# Altium schematic sheet Dissipation de puissance.SchDoc: =SchTitle
size 276 x 198 mm; Organization: ETML; Address1: Rue de Sébeillon12; Address2: CH - 1004 Lausanne; Address3: Tél. 021 316 77 77; Address4: www.etml.ch; SheetNumber: 2; SheetTotal: 4; Replace: .; ModA: .; ModB: .; ModC: .; ModD: .
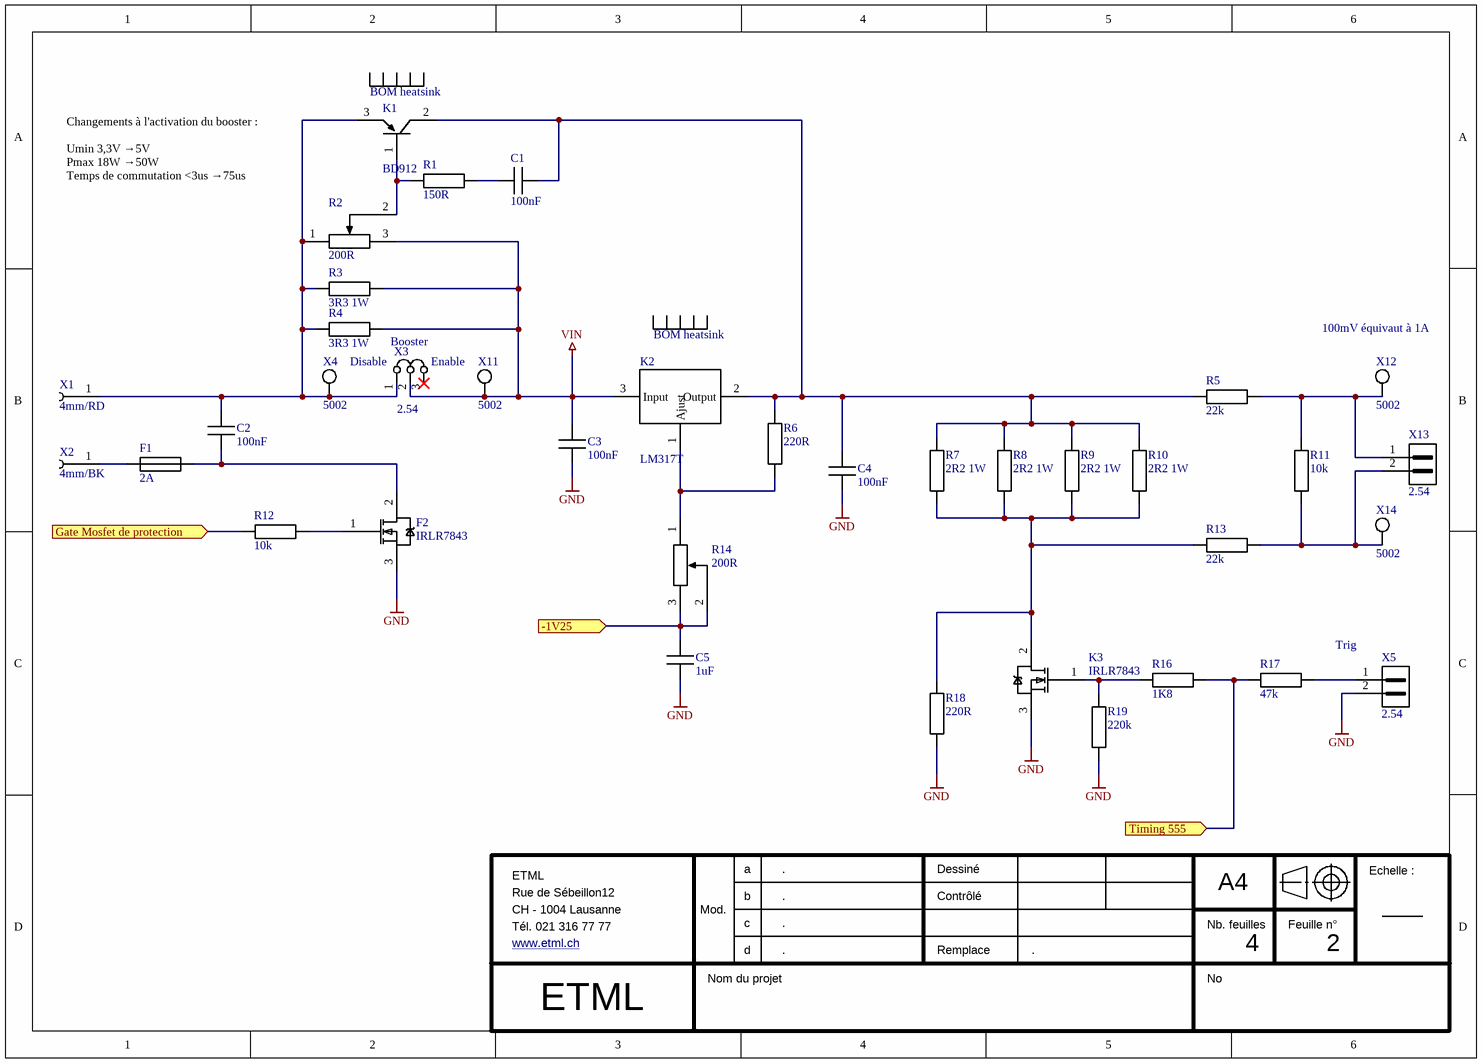
[diagram p0: Dissipation de puissance.SchDoc]

## Parts
C1  100nF  [CAPC2012X08M]
C2  100nF  [CAPC2012X08M]
C3  100nF  [CAPC2012X08M]
C4  100nF  [CAPC2012X08M]
C5  1uF  [CAPC2012X08M]
E1  WAKEFIELD THERMAL 678-39-C  [Designator]  (value not drawn)
E2  WAKEFIELD THERMAL 678-39-C  [Designator]  (value not drawn)
F1  2A  [WE_696103201002]
F2  IRLR7843  [DPAK228P991X238-3M]
K1  BD912  [TO220 With WAKEFIELD THERMAL 678-39-C]
K2  LM317T  [TO220 With WAKEFIELD THERMAL 678-39-C]
K3  IRLR7843  [DPAK228P991X238-3M]
R1  150R  [RESC2012X06M]
R2  200R  [FP-3296W-MFG]
R3  3R3 1W  [NEOHM 1W ROX1S]
R4  3R3 1W  [NEOHM 1W ROX1S]
R5  22k  [RESC2012X06M]
R6  220R  [RESC2012X06M]
R7  2R2 1W  [NEOHM 1W ROX1S]
R8  2R2 1W  [NEOHM 1W ROX1S]
R9  2R2 1W  [NEOHM 1W ROX1S]
R10  2R2 1W  [NEOHM 1W ROX1S]
R11  10k  [RESC2012X06M]
R12  10k  [RESC2012X06M]
R13  22k  [RESC2012X06M]
R14  200R  [FP-3296W-MFG]
R16  1K8  [RESC2012X06M]
R17  47k  [RESC2012X06M]
R18  220R  [RESC2012X06M]
R19  220k  [RESC2012X06M]
X1  4mm/RD  [SKS_973582101]
X2  4mm/BK  [SKS_973582100]
X3  2.54  [PIN-1x03-2.54]
X4  5002  [Keystone_5002]
X5  2.54  [PIN-1x02-2.54]
X11  5002  [Keystone_5002]
X12  5002  [Keystone_5002]
X13  2.54  [PIN-1x02-2.54]
X14  5002  [Keystone_5002]

## Ports
-1V25 (in), Gate Mosfet de protection (in), Timing 555 (in)

## Nets
GND: C3.1 C4.1 C5.1 F2.3(S) K3.3(S) R18.1 R19.1 X5.2
VIN: C3.2 K2.3(Input) R2.3 R3.2 R4.2 X3.2 X11.1(TP)
-1V25: C5.2 R14.2 R14.3 ; port -1V25
Gate Mosfet de protection: R12.1 ; port Gate Mosfet de protection
Timing 555: R16.2 R17.1 ; port Timing 555
NetC1_1: C1.1 C4.2 K1.2(Collector) K2.2(Output) R5.1 R6.2 R7.2 R8.2 R9.2 R10.2
NetC1_2: C1.2 R1.2
NetC2_1: C2.1 F1.2 F2.2(D)
NetC2_2: C2.2 K1.3(Emitter) R2.1 R3.1 R4.1 X1.1 X3.1 X4.1(TP)
NetF1_1: F1.1 X2.1
NetF2_1: F2.1(G) R12.2
NetK1_1: K1.1(Base) R1.1 R2.2
NetK2_1: K2.1(Ajust) R6.1 R14.1
NetK3_1: K3.1(G) R16.1 R19.2
NetK3_2: K3.2(D) R7.1 R8.1 R9.1 R10.1 R13.1 R18.2
NetR5_2: R5.2 R11.2 X12.1(TP) X13.1
NetR11_1: R11.1 R13.2 X13.2 X14.1(TP)
NetR17_2: R17.2 X5.1

Not connected (* = marked no-connect by the designer): X3 3*

## Notes on the sheet
- Changements à l'activation du booster :
  Umin 3,3V →5V
  Pmax 18W →50W
  Temps de commutation <3us →75us
- (near X12) 100mV équivaut à 1A
- (near X3) Disable
- Booster
- (near X3) Enable
- Trig
- a
- Dessiné
- A4
- Echelle :
- Mod.
- b
- c
- d
- Contrôlé
- Remplace
- Nb. feuilles
- Feuille n°
- Nom du projet
- No
- (in symbol WAKEFIELD THERMAL 678-39-C) BOM heatsink

## Library data of the parts
C1-C4 = CMP-065-000038-2: CAPC 100nF X7R 50V 10% 2012 (0805 INCH); Manufacturer Number: C2012X7R1H104K085AA; Manufacturer: TDK; IsStocked: 1; TemperatureRange: -55°C to +125°C; PN: KAM21AR81H104KU; Supplier Part Number 1: 581-KAM21AR81H104KU; Supplier Price 1: 0.259; Voltage: 50V; Dielectric: X7R; Value: 100nF; SubCategory: Condensateurs ceramique; Category: Passives; Tolerance: ±10%; Supplier 1: Mouser
C5 = CMP-065-000041-2: CAPC 1uF X5R 25V 10% 2012 (0805 INCH); Manufacturer: TDK; Manufacturer Number: KGM21AR51E105KU; Value: 1µF; TemperatureRange: -55°C to +85°C; IsStocked: 1; Supplier 1: Mouser; Category: Passives; Supplier Part Number 1: 581-KGM21AR51E105KU; SubCategory: Condensateurs ceramique; Tolerance: ±10%; Supplier Price 1: 1; Dielectric: X5R; Voltage: 25V; PN: KGM21AR51E105KU
E1 E2 = WAKEFIELD THERMAL 678-39-C: HEAT SINK, ALUMINIUM, TO-PACKAGE, SMD
F1 = CMP-067-000003-1: Fusible FST 2A temporisé; Manufacturer: Würth Electronik; Manufacturer Number: 696103201002; TemperatureRange: -30°C to +120°C; Voltage: 250VAC; PN: 261.476; Value: 5x20mm; IsStocked: True; Supplier Part Number 1: MAG 261.476; Current: 2A; SubCategory: Fusibles; Category: Protections; Supplier 1: ETML; Supplier Price 1: 0.33
F2 K3 = IRLR7843: N channel Mosfet
K1 = BD912: PNP transistor
K2 = LM317T: TO-220 ajustable votage regulator
R1 = CMP-066-000177-2: RES 150ohm  ±1% 0.125W 2012 (0805 INCH); Manufacturer: Yageo; Manufacturer Number: RC0805FR-07150RL; Value: 150; TemperatureRange: -55°C to 155°C; Voltage: 150V; TemperatureCoeff: ±200ppm/°C; PN: PN-455993; IsStocked: 1; Supplier Price 1: 0.0200; Tolerance: ±1%; SubCategory: Resistances couche epaisse; Power: 0.125W; Supplier Part Number 1: FAB.0805_R 150R; Supplier 1: ETML; Category: Passives
R2 R14 = CMP-066-000235-2: RESADJ 200ohm Cermet 25 turns; Manufacturer: Bourns Incorporated; Tolerance: ±10%; TemperatureCoeff: ±100ppm/°C; IsStocked: 1; PN: PN-614445; Power: 500mW; TemperatureRange: -55°C to +125°C; Supplier 1: Farnell; Category: Passives; Supplier Price 1: 3.36; Value: 200R; Supplier Part Number 1: 9353747; SubCategory: Resistances ajustables
R3 R4 = NEOHM - TE CONNECTIVITY ROX1SJ3R3: Résistance traversante, 3.3 ohm, ROX, 1 W, ± 5%, Axial, 350 V; Manufacturer Number: MRS25000C3308FCT00; Manufacturer: Vishay; PN: PN-918915; Voltage: 350V; Power: 0.6W; TemperatureRange: -55°C to 155°C; Value: 3.3; Tolerance: ±1%; IsStocked: 1; TemperatureCoeff: ±50ppm/°C; Supplier Price 1: 0.1500; SubCategory: Resistances film metallique; Category: Passives; Supplier 1: Farnell; Supplier 2: Mouser; Supplier 3: Digikey; Supplier Part Number 1: 3399704; Supplier Part Number 2: 279-ROX1SJ3R3; Supplier Part Number 3: A131468CT-ND
R5 R13 = CMP-066-000203-2: RES 22kohm  ±1% 0.125W 2012 (0805 INCH); Manufacturer: Yageo; Manufacturer Number: RC0805FR-0722KL; PN: PN-851075; Voltage: 150V; TemperatureCoeff: ±200ppm/°C; TemperatureRange: -55°C to 155°C; IsStocked: 1; Tolerance: ±1%; Supplier Part Number 1: FAB.0805_R 22k; SubCategory: Resistances couche epaisse; Value: 22k; Supplier Price 1: 0.0200; Supplier 1: ETML; Category: Passives; Power: 0.125W
R6 R18 = CMP-066-000179-2: RES 220ohm  ±1% 0.125W 2012 (0805 INCH); Manufacturer: Yageo; Manufacturer Number: RC0805FR-07220RL; TemperatureRange: -55°C to 155°C; Voltage: 150V; IsStocked: 1; TemperatureCoeff: ±200ppm/°C; PN: PN-694076; Value: 220; SubCategory: Resistances couche epaisse; Supplier Price 1: 0.0200; Category: Passives; Supplier Part Number 1: FAB.0805_R 220R; Supplier 1: ETML; Tolerance: ±1%; Power: 0.125W
R7-R10 = NEOHM - TE CONNECTIVITY ROX1SJ2R2: Résistance traversante, 2.2 ohm, ROX, 1 W, ± 5%, Axial, 350 V; Manufacturer Number: MRS25000C3308FCT00; Manufacturer: Vishay; PN: PN-918915; Voltage: 350V; Power: 0.6W; TemperatureRange: -55°C to 155°C; Value: 2.2; Tolerance: ±1%; IsStocked: 1; TemperatureCoeff: ±50ppm/°C; Supplier Price 1: 0.1500; SubCategory: Resistances film metallique; Category: Passives; Supplier 1: Farnell; Supplier 2: Mouser; Supplier 3: Digikey; Supplier Part Number 1: 3399704; Supplier Part Number 2: 279-ROX1SJ3R3; Supplier Part Number 3: A131468CT-ND
R11 R12 = CMP-066-000199-2: RES 10kohm  ±1% 0.125W 2012 (0805 INCH); Manufacturer Number: RC0805FR-0710KL; Manufacturer: Yageo; PN: PN-374909; TemperatureCoeff: ±200ppm/°C; Voltage: 150V; TemperatureRange: -55°C to 155°C; IsStocked: 1; Tolerance: ±1%; Category: Passives; Value: 10k; Supplier Price 1: 0.0200; Supplier Part Number 1: FAB.0805_R 10k; Supplier 1: ETML; SubCategory: Resistances couche epaisse; Power: 0.125W
R16 = CMP-066-000190-2: RES 1.8kohm  ±1% 0.125W 2012 (0805 INCH); Manufacturer Number: RC0805FR-071K8L; Manufacturer: Yageo; TemperatureRange: -55°C to 155°C; Voltage: 150V; IsStocked: 1; PN: PN-653534; TemperatureCoeff: ±200ppm/°C; Value: 1.8k; Power: 0.125W; Supplier Part Number 1: FAB.0805_R 1K8; Category: Passives; Tolerance: ±1%; Supplier Price 1: 0.0200; Supplier 1: ETML; SubCategory: Resistances couche epaisse
R17 = CMP-066-000207-2: RES 47kohm  ±1% 0.125W 2012 (0805 INCH); Manufacturer Number: RC0805FR-0747KL; Manufacturer: Yageo; TemperatureRange: -55°C to 155°C; Voltage: 150V; IsStocked: 1; TemperatureCoeff: ±200ppm/°C; PN: PN-427242; Category: Passives; Supplier Price 1: 0.0200; Power: 0.125W; Supplier 1: ETML; Tolerance: ±1%; SubCategory: Resistances couche epaisse; Supplier Part Number 1: FAB.0805_R 47k; Value: 47k
R19 = CMP-066-000215-2: RES 220kohm  ±1% 0.125W 2012 (0805 INCH); Manufacturer Number: RC0805FR-07220KL; Manufacturer: Yageo; PN: PN-479575; IsStocked: 1; TemperatureCoeff: ±200ppm/°C; Voltage: 150V; TemperatureRange: -55°C to 155°C; Value: 220k; Power: 0.125W; Tolerance: ±1%; Supplier Price 1: 0.0200; SubCategory: Resistances couche epaisse; Supplier 1: ETML; Category: Passives; Supplier Part Number 1: FAB.0805_R 220k
X1 = CMP-054-000001-1: Embase 4mm PCB 16A 60VDC Sn Red; Manufacturer: SKS Kontakttechnik GmbH; Manufacturer Number: 973582101; TemperatureRange: -25°C to +85°C; PN: PN-628499; Dielectric: PC; IsStocked: True; Value: 4mm/RD; Supplier Price 1: 1.7; Supplier 1: ETML; Current: 16A; Voltage: 60VDC; SubCategory: Laboratoire; Category: Connectors; Supplier Part Number 1: MAG.277.666
X2 = CMP-054-000000-1: Embase 4mm PCB 16A 60VDC Sn Black; Manufacturer: SKS Kontakttechnik GmbH; Manufacturer Number: 973582100; Dielectric: PC; TemperatureRange: -25°C to +85°C; IsStocked: True; PN: PN-390416; SubCategory: Laboratoire; Supplier 1: ETML; Supplier Price 1: 1.51; Value: 4mm/BK; Supplier Part Number 1: MAG.277.665; Voltage: 60VDC; Current: 16A; Category: Connectors
X3 = CMP-054-000017-1: JUMPER 2.54 1x03; Manufacturer Number: 61303611121; Manufacturer: Würth Electronik; Current: 3A; IsStocked: True; PN: PN-771444; Voltage: 250VAC; TemperatureRange: -40°C to +105 °C; Supplier 1: ETML; Supplier Price 1: 0.06; Category: Connectors; SubCategory: Jumpers; Supplier Part Number 1: MAG.283.897; Value: 2.54
X4 X11 X12 X14 = CMP-054-000004-1: TEST THT MINIATURE WT; Manufacturer: Keystone; PN: PN-357949; IsStocked: True; Category: Connectors; Value: 5002; Supplier Part Number 1: MAG.428.013; Supplier 1: ETML; Supplier Price 1: 0.2931; SubCategory: Testpoints; Manufacturer Number: 5002
X5 X13 = CMP-055-000006-1: PIN HEADER 2.54 1x02; Manufacturer Number: 61300211121; Manufacturer: Würth Electronik; IsStocked: True; PN: PN-573903; Voltage: 250V; Current: 3A; TemperatureRange: -40°C to +105°C; Supplier Part Number 1: MAG.283.897; Supplier Price 1: 0.04; Supplier 1: ETML; SubCategory: Pin Header; Category: Connectors; Value: 2.54